# Altium schematic sheet UKU208_eth.SchDoc
size A3
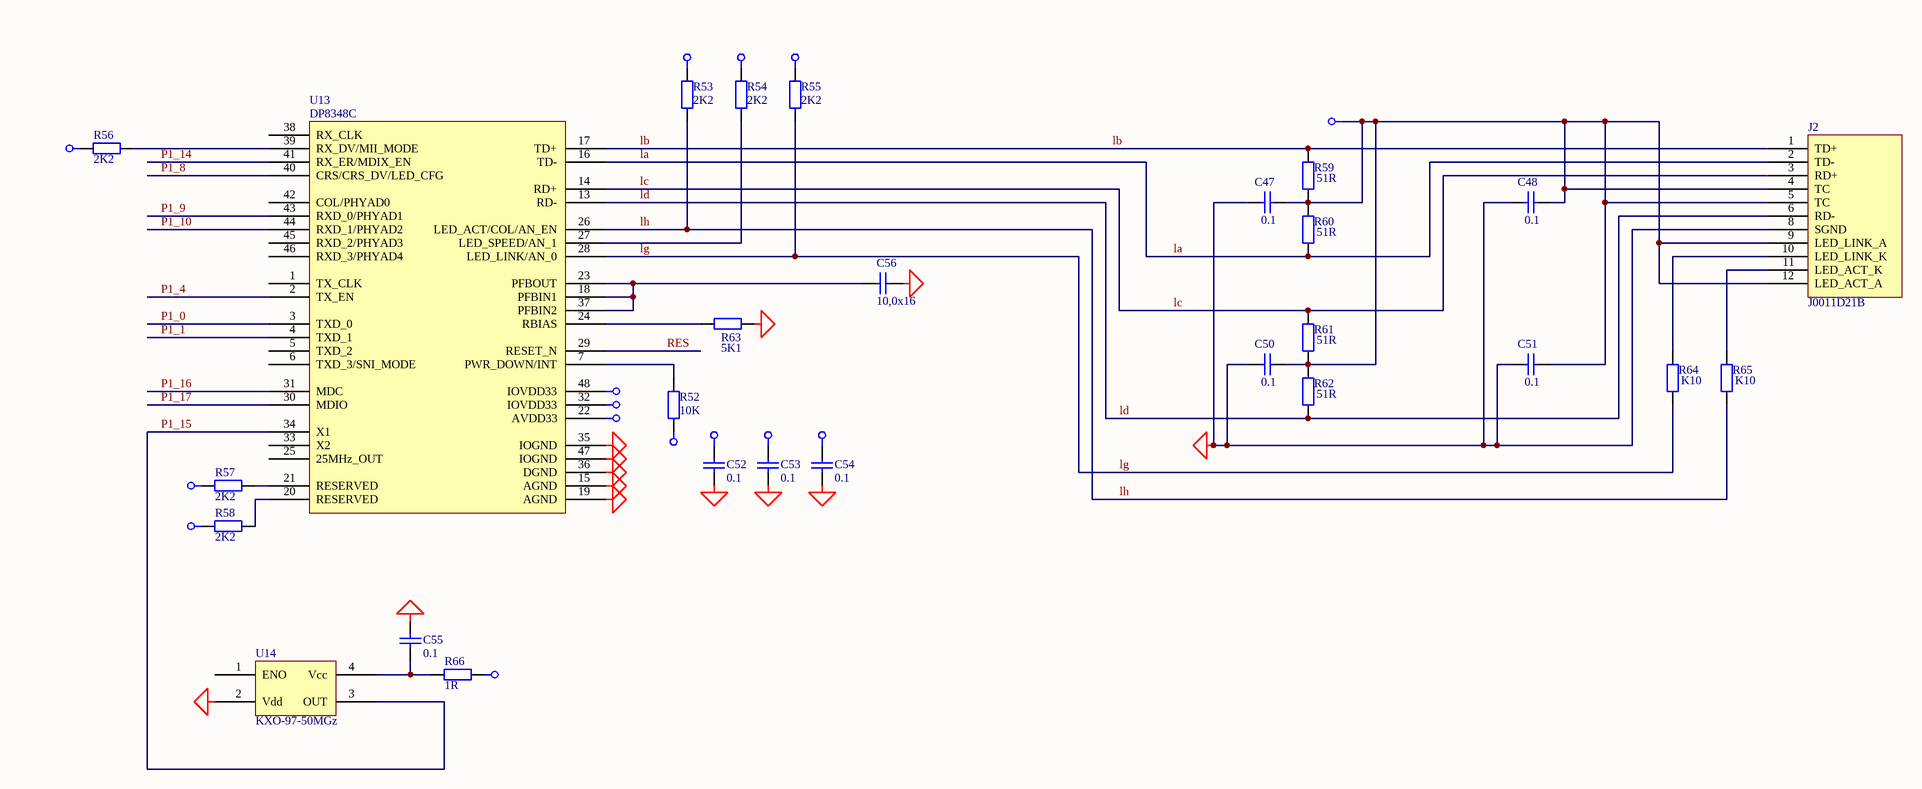
[diagram p0: UKU208_eth.SchDoc]

## Parts
C47  0.1  [_1206]
C48  0.1  [_1206]
C50  0.1  [_1206]
C51  0.1  [_1206]
C52  0.1  [_1206]
C53  0.1  [_1206]
C54  0.1  [_1206]
C55  0.1  [_1206]
C56  10,0x16  [_1206]
J2  J0011D21B  [J0011D21B]
R52  10K  [_1206]
R53  2K2  [_1206]
R54  2K2  [_1206]
R55  2K2  [_1206]
R56  2K2  [_1206]
R57  2K2  [_1206]
R58  2K2  [_1206]
R59  51R  [_1206]
R60  51R  [_1206]
R61  51R  [_1206]
R62  51R  [_1206]
R63  5K1  [_1206]
R64  K10  [_1206]
R65  K10  [_1206]
R66  1R  [_1206]
U13  DP8348C  [F-QFP7X7-G48/N]
U14  KXO-97-50MGz  [KXO-97]

## Nets
+3v3: C47.2 C48.2 C50.2 C51.2 C52.1 C53.1 C54.1 J2.4(TC) J2.5(TC) J2.9(LED_LINK_A) J2.12(LED_ACT_A) R52.2 R53.2 R54.2 R55.2 R56.2 R57.2 R58.2 R59.2 R60.1 R61.2 R62.1 U13.22(AVDD33) U13.32(IOVDD33) U13.48(IOVDD33)
+5v: R66.2
GND: C47.1 C48.1 C50.1 C51.1 C52.2 C53.2 C54.2 C55.2 C56.2 J2.8(SGND) R63.1 U13.15(AGND) U13.19(AGND) U13.35(IOGND) U13.36(DGND) U13.47(IOGND) U14.2(Vdd)
la: J2.2(TD-) R60.2 U13.16(TD-)
lb: J2.1(TD+) R59.1 U13.17(TD+)
lc: J2.3(RD+) R61.1 U13.14(RD+)
ld: J2.6(RD-) R62.2 U13.13(RD-)
lg: R55.1 R64.2 U13.28(LED_LINK/AN_0)
lh: R53.1 R65.2 U13.26(LED_ACT/COL/AN_EN)
P1_0: U13.3(TXD_0)
P1_1: U13.4(TXD_1)
P1_4: U13.2(TX_EN)
P1_8: U13.40(CRS/CRS_DV/LED_CFG)
P1_9: U13.43(RXD_0/PHYAD1)
P1_10: U13.44(RXD_1/PHYAD2)
P1_14: U13.41(RX_ER/MDIX_EN)
P1_15: U13.34(X1) U14.3(OUT)
P1_16: U13.31(MDC)
P1_17: U13.30(MDIO)
RES: U13.29(RESET_N)
NetC55_1: C55.1 R66.1 U14.4(Vcc)
NetC56_1: C56.1 U13.18(PFBIN1) U13.23(PFBOUT) U13.37(PFBIN2)
NetJ2_10: J2.10(LED_LINK_K) R64.1
NetJ2_11: J2.11(LED_ACT_K) R65.1
NetR52_1: R52.1 U13.7(PWR_DOWN/INT)
NetR54_1: R54.1 U13.27(LED_SPEED/AN_1)
NetR56_1: R56.1 U13.39(RX_DV/MII_MODE)
NetR57_1: R57.1 U13.21(RESERVED)
NetR58_1: R58.1 U13.20(RESERVED)
NetR63_2: R63.2 U13.24(RBIAS)

Not connected (* = marked no-connect by the designer): U13 1(TX_CLK) 5(TXD_2) 6(TXD_3/SNI_MODE) 25(25MHz_OUT) 33(X2) 38(RX_CLK) 42(COL/PHYAD0) 45(RXD_2/PHYAD3) 46(RXD_3/PHYAD4); U14 1(ENO)

## Library data of the parts
C47 C48 C50-C56 = Cap Semi: Capacitor (Semiconductor SIM Model); Manufacturer: Generic Components; Class I: Passive; Value: 1,0; Published: 8-Jun-2000; Revision: July-2002: Re-released for DXP Platform.; Publisher: Altium Limited; Class II: Capacitor
R52 = Res2: Resistor; Manufacturer: Generic Components; Class I: Passive; Rule: Undefined; Published: 8-Jun-2000; Revision: July-2002: Re-released for DXP Platform.; Publisher: Altium Limited; Class II: Resistor; Value: 10K
R53-R58 R63 R66 = Res2: Resistor; Manufacturer: Generic Components; Class I: Passive; Value: 10K; Rule: Undefined; Published: 8-Jun-2000; Revision: July-2002: Re-released for DXP Platform.; Publisher: Altium Limited; Class II: Resistor
R59-R62 R64 R65 = Res2: Resistor; Manufacturer: Generic Components; Class I: Passive; Value: 30; Rule: Undefined; Published: 8-Jun-2000; Revision: July-2002: Re-released for DXP Platform.; Publisher: Altium Limited; Class II: Resistor
U14 = KXO-97